# Altium project Battery Management Board.PrjPcb
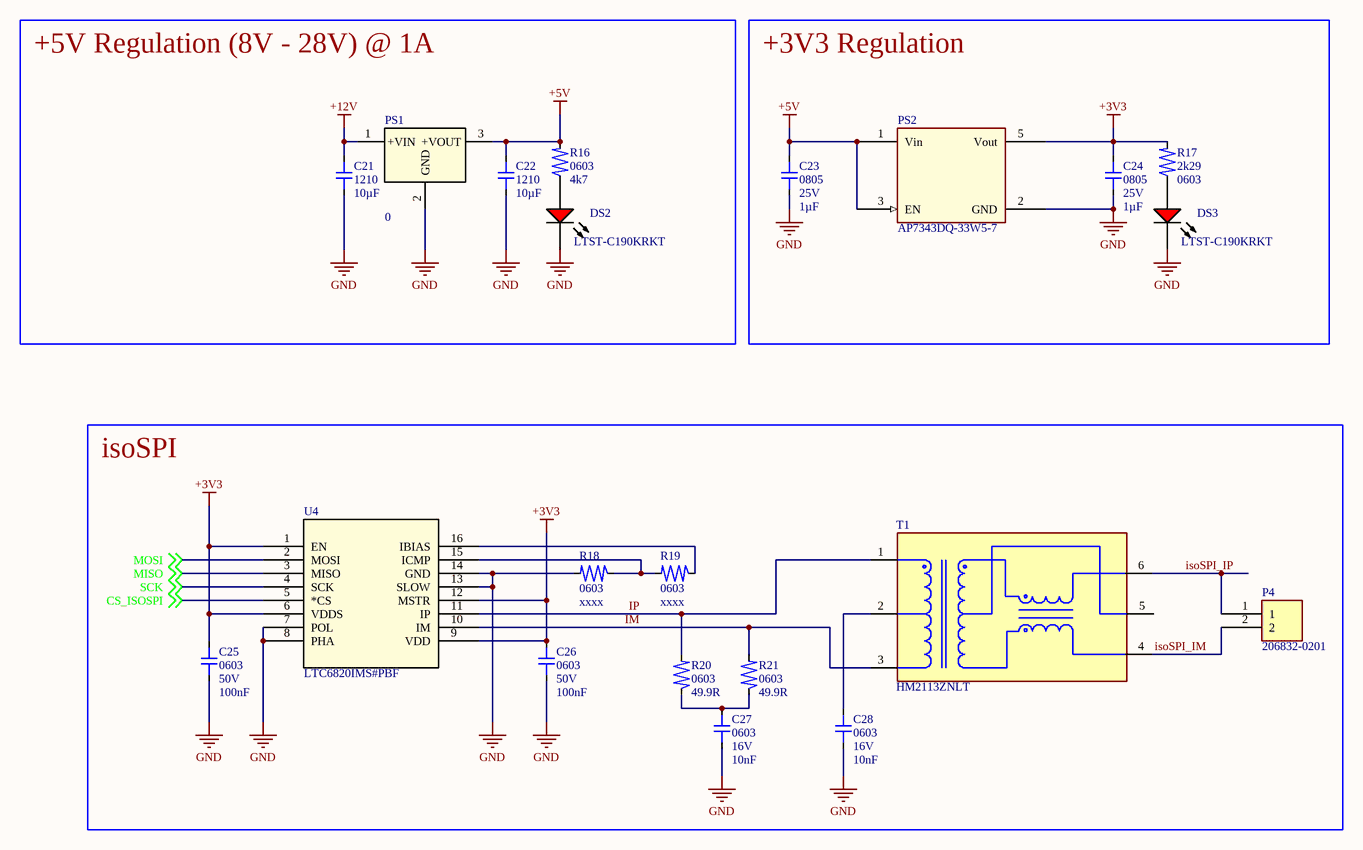
[diagram p0: Power Management.SchDoc]
Comment_1: Initial Release of Schematic; Date_1: 5/17/2024; DrawnBy_1: Ethan Zifzal; PartNumber: EL#####; ProjectTitle: STM32F405 MCU Template; Revision: AA; Revision_1: AA
4 sheets, 116 parts. Net scope: global (net labels, ports and power ports of the same name join across sheets).
Board file: BMS REVAA.PcbDoc
Sheets:
  Sheet1.SchDoc
  Power Management.SchDoc
  Shutdown.SchDoc
  STM32.SchDoc

## Sheet Sheet1.SchDoc
size Tabloid; SheetNumber: 1; SheetTotal: 4

### Notes on the sheet
- REVISION
- DATE
- DRAWN BY
- COMMENT
- Notes
- THE UNIVERSITY OF AKRON
- SHEET SIZE
- TITLE
- PART NUMBER
- ANSI B
- LAST UPDATE
- SHEET

## Sheet Power Management.SchDoc
size Tabloid; SheetNumber: 2; SheetTotal: 4

### Parts
C21  value 10µF  Footprint: 1210  [FP-1210-L_3_2_0_3-W_2_5_0-MFG]  (hidden comment: Capacitor 10uF 1210 50V)
C22  value 10µF  Footprint: 1210  [FP-1210-L_3_2_0_3-W_2_5_0-MFG]  (hidden comment: Capacitor 10uF 1210 50V)
C23  value 1µF  Footprint: 0805  Voltage: 25V  [CAP-0805]  (hidden comment: Capacitor 1uF 0805 25V)
C24  value 1µF  Footprint: 0805  Voltage: 25V  [CAP-0805]  (hidden comment: Capacitor 1uF 0805 25V)
C25  value 100nF  Footprint: 0603  Voltage: 50V  [CAP-0603-Generic]  (hidden comment: Capacitor 100nF 0603 5%)
C26  value 100nF  Footprint: 0603  Voltage: 50V  [CAP-0603-Generic]  (hidden comment: Capacitor 100nF 0603 5%)
C27  value 10nF  Footprint: 0603  Voltage: 16V  [CAP-0603-Generic]  (hidden comment: Capacitor 10nF 0603 5%)
C28  value 10nF  Footprint: 0603  Voltage: 16V  [CAP-0603-Generic]  (hidden comment: Capacitor 10nF 0603 5%)
DS2  LTST-C190KRKT  [LTST-C191KRKT_V]
DS3  LTST-C190KRKT  [LTST-C191KRKT_V]
P4  206832-0201  [FP-206832-0201-MFG]
PS1  value 0  [CONV_R-78E5.0-1.0]  (hidden comment: R-78E5.0-1.0)
PS2  AP7343DQ-33W5-7  [SOT95P285X140-5N]
R16  value 4k7  Footprint: 0603  [RES-0603-Generic]  (hidden comment: Resistor 4k7 0603 1%)
R17  value 2k29  Footprint: 0603  [RES-0603-Generic]  (hidden comment: Resistor 2k49 0603 1%)
R18  value xxxx  Footprint: 0603  [RES-0603-Generic]  (hidden comment: XXX)
R19  value xxxx  Footprint: 0603  [RES-0603-Generic]  (hidden comment: XXX)
R20  value 49.9R  Footprint: 0603  [RES-0603-Generic]  (hidden comment: 49R9 0603 1%)
R21  value 49.9R  Footprint: 0603  [RES-0603-Generic]  (hidden comment: 49R9 0603 1%)
T1  HM2113ZNLT  [FP-HM2113ZNLT-MFG]
U4  LTC6820IMS#PBF  [MSOP16_MS_ADI]

### Blocks framed on the sheet
+5V Regulation (8V - 28V) @ 1A: C21 C22 DS2 PS1 R16
+3V3 Regulation: C23 C24 DS3 PS2 R17
isoSPI: C25-C28 P4 R18-R21 T1 U4

### Nets
+3V3: C24.2 C25.2 C26.2 PS2.5(Vout) R17.2 U4.1(EN) U4.6(VDDS) U4.9(VDD) U4.12(MSTR)
+5V: C22.2 C23.2 PS1.3(+VOUT) PS2.1(Vin) PS2.3(EN) R16.2
+12V: C21.2 PS1.1(+VIN)
GND: C21.1 C22.1 C23.1 C24.1 C25.1 C26.1 C27.1 C28.1 DS2.2(K) DS3.2(K) PS1.2(GND) PS2.2(GND) R18.2 U4.7(POL) U4.8(PHA) U4.13(SLOW) U4.14(GND)
CS_ISOSPI: U4.5(*CS) ; off-sheet CS_ISOSPI
IM: R21.2 T1.3 U4.10(IM)
IP: R20.2 T1.1 U4.11(IP)
isoSPI_IM: P4.2 T1.4
isoSPI_IP: P4.1 T1.6
MISO: U4.3(MISO) ; off-sheet MISO
MOSI: U4.2(MOSI) ; off-sheet MOSI
SCK: U4.4(SCK) ; off-sheet SCK
NetC27_2: C27.2 R20.1 R21.1
NetC28_2: C28.2 T1.2
NetDS2_1: DS2.1(A) R16.1
NetDS3_1: DS3.1(A) R17.1
NetR18_1: R18.1 R19.2 U4.15(ICMP)
NetR19_1: R19.1 U4.16(IBIAS)

Not connected (* = marked no-connect by the designer): PS2 4(NC); T1 5

### Notes on the sheet
- THE UNIVERSITY OF AKRON
- SHEET SIZE
- TITLE
- PART NUMBER
- REVISION
- ANSI B
- LAST UPDATE
- SHEET

### Library data of the parts
C21 C22 = CMP-001-00122-1: Capacitor 1210; Capacitor Type: Ceramic; Max Operating Temperature: 85°C; Pins: 2; Mounting Technology: Surface Mount; Case/Package: 1210; Min Operating Temperature: -55°C; RoHS Compliant: Yes; Voltage Rating: 50V
C23 C24 = CMP-00045-1: Capacitor, 0805
C25 C26 = CMP-00030-2: Capacitor, 0603, 5%; Max Operating Temperature: 125°C; Min Operating Temperature: -55°C
C27 C28 = CMP-00044-1: Capacitor, 0603, 5%; Min Operating Temperature: -55°C; Max Operating Temperature: 125°C
DS2 DS3 = CMP-007-00024-2: LED Uni-Color Red, 62.5 mW, 25 mA, -30 to 85 degC, 2-Pin SMD, RoHS, Tape and Reel; Manufacturer: Lite-On; Power: 75mW; Forward Voltage: 2V; Luminous Intensity: 54mcd; Lens Style: Diffused; Viewing Angle: 130degrees; Forward Current: 20mA; Manufacturer URL: http://www.us.liteon.com/; Case/Package: 0603; Datasheet Version: Rev. F, 05/2013; Package Reference: C191KRKT; Datasheet URL: http://optoelectronics.liteon.com/upload/download/DS-22-99-0151/S_110_LTST-C190KRKT.pdf; Package Description: 2-Pin Surface Mount Device, Body 1.6 x 0.8 mm; Nominal Vf: 2V; Packaging: TapeandReel; RoHS Compliant: True; Pins: 2; Illumination Colour: Red; Colour: Red; Mounting Technology: SM; Package Quantity: 3000; Min Operating Temperature: -55°C; Max Operating Temperature: 85°C
P4 = CMP-002-00123-3: Molex, Micro-Fit+, 2 Position, Dual-Row, Header, Male, 3mm Pitch; Max Current Rating: 13A; Voltage Rating: 600V
PS1 = CMP-009-00214-2: Linear Regulator Replacement DC DC Converter 1 Output 5V - - 1A 8V - 28V Input; MF: Recom Power; Price: None; Availability: Unavailable; SnapEDA_Link: https://www.snapeda.com/parts/R-78E5.0-1.0/Recom%20Power/view-part/557753/?ref=snap; Case/Package: SIP-3 Recom Power; Design Item ID: R-78E5.0-1.0; MP: R-78E5.0-1.0; Source: Zips_Racing_Electric.SchLib
PS2 = CMP-019-00053-6: Fixed Positive LDO Regulator; Min Supply Voltage: 1.7V; Output Current: 300mA; Max Supply Voltage: 5.25V; Output Voltage: 3.3V; Dropout Voltage: 310mV; Mounting Technology: SMT; Min Operating Temperature: -40°C; Pins: 5; Case/Package: SOT-25; Max Operating Temperature: 125°C
R16 = CMP-00023-3: Resistor, 0603, 1%, 1/10W; Power: 100mW; Tolerance: 1%; Datasheet: https://www.seielect.com/catalog/sei-rmcf_rmcp.pdf; Max Operating Temperature: 155°C; Min Operating Temperature: -55°C
R17 = CMP-00028-1: Resistor, 0603, 1%, 1/10W; Power: 100mW; Max Operating Temperature: 155°C; Min Operating Temperature: -55°C; Tolerance: 1%; Datasheet: https://www.seielect.com/catalog/sei-rmcf_rmcp.pdf
R18 R19 = CMP-00061-1: Resistor, 0603, 49R9; Tolerance: 1%; Power: 100mW; Max Operating Temperature: 155°C; Datasheet: https://www.seielect.com/catalog/sei-rmcf_rmcp.pdf; Min Operating Temperature: -55°C
R20 R21 = CMP-00061-1: Resistor, 0603, 49R9; Power: 100mW; Max Operating Temperature: 155°C; Tolerance: 1%; Datasheet: https://www.seielect.com/catalog/sei-rmcf_rmcp.pdf; Min Operating Temperature: -55°C
T1 = CMP-012-00001-1: Datacom Transformer; RoHS Compliant: Yes; Transformer Type: DATACOM TRANSFORMER
U4 = CMP-023-000016-1: Isolated Communications Interface Interface 16-MSOP; Mfr_Name: Analog Devices Inc; Source: Zips_Racing_Electric.SchLib; Type: DEV; Manufacturer_Part_Number: LTC6820IMS#PBF; Digi-Key_Part_Number_1: LTC6820IMS#PBF-ND; RefDes: RefDes; Copyright: Copyright (C) 2021 Ultra Librarian. All rights reserved.; Design Item ID: LTC6820IMS#PBF

## Sheet Shutdown.SchDoc
size Tabloid; SheetNumber: 3; SheetTotal: 4
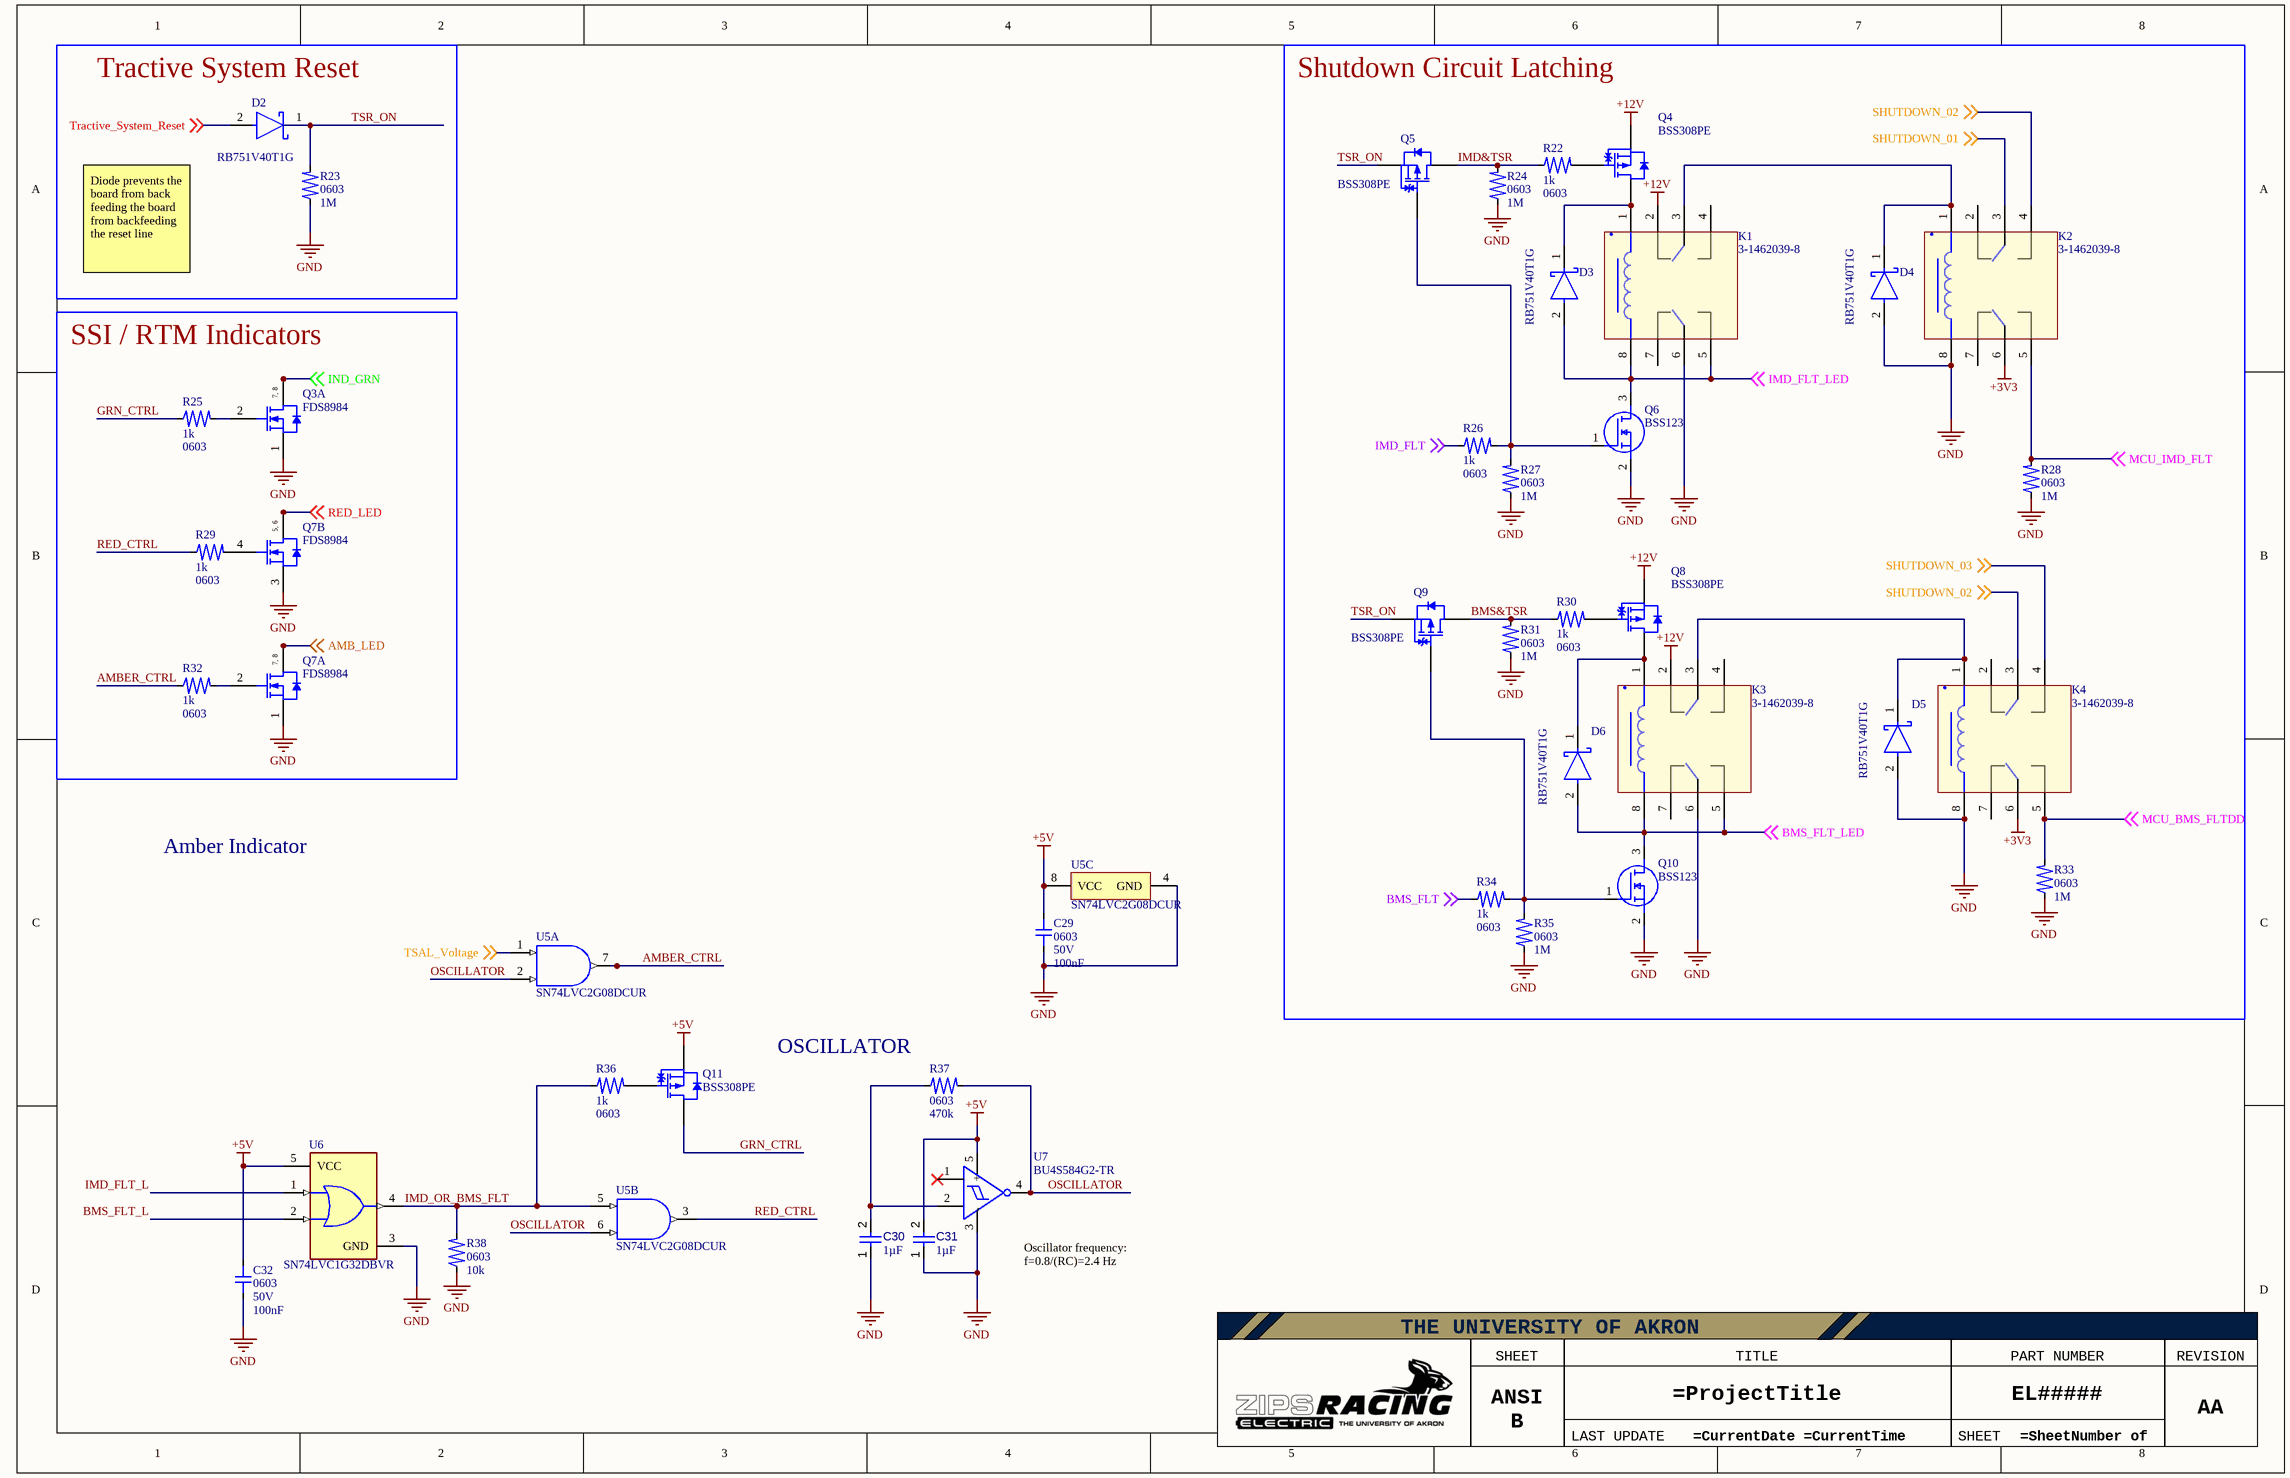
[diagram p1: Shutdown.SchDoc]

### Parts
C29  value 100nF  Footprint: 0603  Voltage: 50V  [CAP-0603-Generic]  (hidden comment: Capacitor 100nF 0603 5%)
C30  value 1µF  [CAPC1608X94X35NL15T15]  (hidden comment: Capacitor 1 uF +/- 10% 16 V 0603)
C31  value 1µF  [CAPC1608X94X35NL15T15]  (hidden comment: Capacitor 1 uF +/- 10% 16 V 0603)
C32  value 100nF  Footprint: 0603  Voltage: 50V  [CAP-0603-Generic]  (hidden comment: Capacitor 100nF 0603 5%)
D2  RB751V40T1G  [FP-477-02-MFG]
D3  RB751V40T1G  [FP-477-02-MFG]
D4  RB751V40T1G  [FP-477-02-MFG]
D5  RB751V40T1G  [FP-477-02-MFG]
D6  RB751V40T1G  [FP-477-02-MFG]
K1  3-1462039-8  [FP-3-1462039-8-MFG]
K2  3-1462039-8  [FP-3-1462039-8-MFG]
K3  3-1462039-8  [FP-3-1462039-8-MFG]
K4  3-1462039-8  [FP-3-1462039-8-MFG]
Q3  FDS8984  [FAIR-SOIC-8_V]  (part A of 2)
Q4  BSS308PE  [INF-PG-SOT23_M]
Q5  BSS308PE  [INF-PG-SOT23_M]
Q6  BSS123  [SOT96P237X111-3N]
Q7  FDS8984  [FAIR-SOIC-8_V]  (parts A,B of 2)
Q8  BSS308PE  [INF-PG-SOT23_M]
Q9  BSS308PE  [INF-PG-SOT23_M]
Q10  BSS123  [SOT96P237X111-3N]
Q11  BSS308PE  [INF-PG-SOT23_M]
R22  value 1k  Footprint: 0603  [RES-0603-Generic]  (hidden comment: Resistor 1k 0603 1%)
R23  value 1M  Footprint: 0603  [RES-0603-Generic]  (hidden comment: Resistor 1M 0603 1%)
R24  value 1M  Footprint: 0603  [RES-0603-Generic]  (hidden comment: Resistor 1M 0603 1%)
R25  value 1k  Footprint: 0603  [RES-0603-Generic]  (hidden comment: Resistor 1k 0603 1%)
R26  value 1k  Footprint: 0603  [RES-0603-Generic]  (hidden comment: Resistor 1k 0603 1%)
R27  value 1M  Footprint: 0603  [RES-0603-Generic]  (hidden comment: Resistor 1M 0603 1%)
R28  value 1M  Footprint: 0603  [RES-0603-Generic]  (hidden comment: Resistor 1M 0603 1%)
R29  value 1k  Footprint: 0603  [RES-0603-Generic]  (hidden comment: Resistor 1k 0603 1%)
R30  value 1k  Footprint: 0603  [RES-0603-Generic]  (hidden comment: Resistor 1k 0603 1%)
R31  value 1M  Footprint: 0603  [RES-0603-Generic]  (hidden comment: Resistor 1M 0603 1%)
R32  value 1k  Footprint: 0603  [RES-0603-Generic]  (hidden comment: Resistor 1k 0603 1%)
R33  value 1M  Footprint: 0603  [RES-0603-Generic]  (hidden comment: Resistor 1M 0603 1%)
R34  value 1k  Footprint: 0603  [RES-0603-Generic]  (hidden comment: Resistor 1k 0603 1%)
R35  value 1M  Footprint: 0603  [RES-0603-Generic]  (hidden comment: Resistor 1M 0603 1%)
R36  value 1k  Footprint: 0603  [RES-0603-Generic]  (hidden comment: Resistor 1k 0603 1%)
R37  value 470k  Footprint: 0603  [RES-0603-Generic]  (hidden comment: Resistor 470k 0603 1%)
R38  value 10k  Footprint: 0603  [RES-0603-Generic]  (hidden comment: Resistor 10k 0603 1%)
U5  SN74LVC2G08DCUR  [DCU0008A_N]  (parts A,B,C of 3)
U6  SN74LVC1G32DBVR  [FP-DBV0005A-MFG]
U7  BU4S584G2-TR  [SSOP5_ROM]

### Blocks framed on the sheet
Tractive System Reset: D2 R23
Shutdown Circuit Latching: D3-D6 K1-K4 Q4-Q6 Q8-Q10 R22 R24 R26-R28 R30 R31 R33-R35
SSI / RTM Indicators: Q3 Q7 R25 R29 R32

### Nets
+3V3: K2.6 K4.6
+5V: C29.2 C31.2 C32.2 Q11.2(SOURCE) U5.8(VCC) U6.5(VCC) U7.5(+)
+12V: K1.2 K3.2 Q4.2(SOURCE) Q8.2(SOURCE)
GND: C29.1 C30.1 C31.1 C32.1 D4.2(A) D5.2(A) K1.6 K2.8 K3.6 K4.8 Q3.1(S1) Q6.2(S) Q7.1(S1) Q7.3(S2) Q10.2(S) R23.1 R24.1 R27.1 R28.1 R31.1 R33.1 R35.1 R38.1 U5.4(GND) U6.3(GND) U7.3(-)
AMB_LED: Q7.7(D1) Q7.8(D1) ; off-sheet AMB_LED
AMBER_CTRL: R32.1 U5.7(1Y)
BMS&TSR: Q9.3(DRAIN) R30.1 R31.2
BMS_FLT: R34.1 ; off-sheet BMS_FLT
BMS_FLT_L: U6.2(B)
BMS_FLT_LED: D6.2(A) K3.5 K3.8 Q10.3(D) ; off-sheet BMS_FLT_LED
GRN_CTRL: Q11.3(DRAIN) R25.1
IMD&TSR: Q5.3(DRAIN) R22.1 R24.2
IMD_FLT: R26.1 ; off-sheet IMD_FLT
IMD_FLT_L: U6.1(A)
IMD_FLT_LED: D3.2(A) K1.5 K1.8 Q6.3(D) ; off-sheet IMD_FLT_LED
IMD_OR_BMS_FLT: R36.1 R38.2 U5.5(2A) U6.4(Y)
IND_GRN: Q3.7(D1) Q3.8(D1) ; off-sheet IND_GRN
MCU_BMS_FLTDD: K4.5 R33.2 ; off-sheet MCU_BMS_FLTDD
MCU_IMD_FLT: K2.5 R28.2 ; off-sheet MCU_IMD_FLT
OSCILLATOR: R37.2 U5.2(1B) U5.6(2B) U7.4
RED_CTRL: R29.1 U5.3(2Y)
RED_LED: Q7.5(D2) Q7.6(D2) ; off-sheet RED_LED
SHUTDOWN_01: K2.3 ; off-sheet SHUTDOWN_01
SHUTDOWN_02: K2.4 K4.3 ; off-sheet SHUTDOWN_02
SHUTDOWN_03: K4.4 ; off-sheet SHUTDOWN_03
Tractive_System_Reset: D2.2(A) ; off-sheet Tractive_System_Reset
TSAL_Voltage: U5.1(1A) ; off-sheet TSAL_Voltage
TSR_ON: D2.1(C) Q5.2(SOURCE) Q9.2(SOURCE) R23.2
NetC30_2: C30.2 R37.1 U7.2
NetD3_1: D3.1(C) K1.1 Q4.3(DRAIN)
NetD4_1: D4.1(C) K1.3 K2.1
NetD5_1: D5.1(C) K3.3 K4.1
NetD6_1: D6.1(C) K3.1 Q8.3(DRAIN)
NetQ3_2: Q3.2(G1) R25.2
NetQ4_1: Q4.1(GATE) R22.2
NetQ5_1: Q5.1(GATE) Q6.1(G) R26.2 R27.2
NetQ7_2: Q7.2(G1) R32.2
NetQ7_4: Q7.4(G2) R29.2
NetQ8_1: Q8.1(GATE) R30.2
NetQ9_1: Q9.1(GATE) Q10.1(G) R34.2 R35.2
NetQ11_1: Q11.1(GATE) R36.2

Not connected (* = marked no-connect by the designer): K1 4 7; K2 2 7; K3 4 7; K4 2 7; U7 1(NC)*

### Notes on the sheet
- Diode prevents the board from back feeding the board from backfeeding the reset line
- Amber Indicator
- (near R37) OSCILLATOR
- (near U7) Oscillator frequency:
  f=0.8/(RC)=2.4 Hz
- THE UNIVERSITY OF AKRON
- SHEET SIZE
- TITLE
- PART NUMBER
- REVISION
- ANSI B
- LAST UPDATE
- SHEET
- (in symbol CMP-008-00010-2) .
- (in symbol CMP-013-00045-1, part A) 7, 8
- (in symbol CMP-013-00045-1, part B) 5, 6

### Library data of the parts
C29 C32 = CMP-00030-2: Capacitor, 0603, 5%; Max Operating Temperature: 125°C; Min Operating Temperature: -55°C
C30 C31 = CMP-001-00003-6: Chip Capacitor, 1 uF, +/- 10%, 16 V, 0603 (1608 Metric); Voltage Rating: 16V; Capacitor Type: Ceramic; Max Operating Temperature: 125°C; Pins: 2; Tolerance: 10%; Min Operating Temperature: -55°C; RoHS Compliant: True; Mounting Technology: SM; Case/Package: 0603
D2-D6 = CMP-004-00075-1: Rectifier Diode, Schottky, 1 Phase, 1 Element, 0.03A, 40V V(RRM), Silicon; Forward Voltage: 370mV; Pins: 2; RoHS Compliant: Yes; Max Operating Temperature: 150°C; Min Operating Temperature: -55°C
K1-K4 = CMP-008-00010-2: Power/Signal Relay, 2 Form C, DPDT, Momentary, 0.01A (Coil), 12VDC (Coil), 140mW (Coil), 5A (Contact), 220VDC (Contact), DC Input, Random, AC/DC Output, Through Hole-Straight Mount; Operate Time: 3ms; Mounting Technology: Through-hole; Pins: 8; Max Operating Temperature: 85°C; Current Rating: 5A; Min Operating Temperature: -40°C; Contact Form: DPDT; RoHS Compliant: Yes; ComponentLink1URL: https://www.te.com/commerce/DocumentDelivery/DDEController?Action=srchrtrv&DocNm=108-98001&DocType=Data+Sheet&DocLang=English&DocFormat=pdf&PartCntxt=3-1462039-8; ComponentLink1Description: Datasheet
Q3 Q7 = CMP-013-00045-1: Power Field-Effect Transistor, 7A I(D), 30V, 0.032ohm, 2-Element, N-Channel, Silicon, Metal-oxide Semiconductor FET; Max Operating Temperature: 150°C; Pins: 8; RoHS Compliant: Yes
Q4 Q5 Q8 Q9 Q11 = CMP-013-00040-1: Small Signal Field-Effect Transistor, 2A I(D), 30V, 1-Element, P-Channel, Silicon, Metal-oxide Semiconductor FET; Pins: 3; RoHS Compliant: Yes
Q6 Q10 = CMP-023-000002-1: MOSFET N-CH 100V 170MA SOT23-3; Manufacturer_Name: ON Semiconductor; Datasheet Link: http://uk.rs-online.com/web/p/products/6710321; Mouser Price/Stock: https://www.mouser.co.uk/ProductDetail/ON-Semiconductor-Fairchild/BSS123?qs=FOlmdCx%252BAA2Kf8SEB3qLYA%3D%3D; Arrow Part Number: BSS123; Arrow Price/Stock: https://www.arrow.com/en/products/bss123/on-semiconductor; Manufacturer_Part_Number: BSS123; Source: Zips_Racing_Electric.SchLib; Design Item ID: BSS123; Height: 1.11mm; Mouser Part Number: 512-BSS123
R22 R25 R26 R29 R30 R32 R34 R36 = CMP-00021-7: Resistor, 0603, 1k; Power: 100mW; Max Operating Temperature: 155°C; Min Operating Temperature: -55°C; Datasheet: https://www.seielect.com/catalog/sei-rmcf_rmcp.pdf; Tolerance: 1%
R23 R24 R27 R28 R31 R33 R35 = CMP-00041-2: Resistor, 0603, 1%, 1/10W; Power: 100mW; Tolerance: 1%; Datasheet: https://www.seielect.com/catalog/sei-rmcf_rmcp.pdf; Max Operating Temperature: 155°C; Min Operating Temperature: -55°C
R37 = CMP-00018-2: Resistor, 0603, 1%, 1/10W; Power: 100mW; Min Operating Temperature: -55°C; Tolerance: 1%; Datasheet: https://www.seielect.com/catalog/sei-rmcf_rmcp.pdf; Max Operating Temperature: 155°C
R38 = CMP-00020-12: Resistor, 0603, 10k; Power: 100mW; Minimum Operating Temperature: -55°C; Tolerance: 1%; Maximum Operating Temperature: 155°C; Max Operating Temperature: 155°C; Min Operating Temperature: -55°C; Datasheet: https://www.seielect.com/catalog/sei-rmcf_rmcp.pdf
U5 = CMP-016-00027-1: AND Gate, LVC/LCX/Z Series, 2-Func, 2-Input, CMOS, PDSO8; Min Supply Voltage: 1.65V; Max Supply Voltage: 5.5V; Nominal Supply Voltage: 1.8V; RoHS Compliant: Yes; Case/Package: VSSOP; Pins: 8; Min Operating Temperature: -40°C; Logic Type: AND GATE; Max Operating Temperature: 125°C
U6 = CMP-016-00020-1: OR Gate, LVC/LCX/Z Series, 1-Func, 2-Input, CMOS, PDSO5; Min Supply Voltage: 1.65V; Logic Type: OR GATE; Nominal Supply Voltage: 3.3V; Max Supply Voltage: 5.5V; Min Operating Temperature: -40°C; Max Operating Temperature: 125°C; Pins: 5; Case/Package: LSSOP; RoHS Compliant: Yes
U7 = CMP-031-00016-1: Inverter IC 1 Channel Schmitt Trigger 5-SSOP; Mfr_Name: ROHM Semiconductor; Manufacturer_Part_Number: BU4S584G2-TR; Copyright: Copyright (C) 2021 Ultra Librarian. All rights reserved.; Design Item ID: BU4S584G2-TR; RefDes: RefDes; Digi-Key_Part_Number_1: BU4S584G2TR-ND; Type: DEV; Digi-Key_Part_Number_2: BU4S584G2CT-ND; Source: Zips_Racing_Electric.SchLib; Digi-Key_Part_Number_3: BU4S584G2DKR-ND

## Sheet STM32.SchDoc
size Tabloid; SheetNumber: 4; SheetTotal: 4
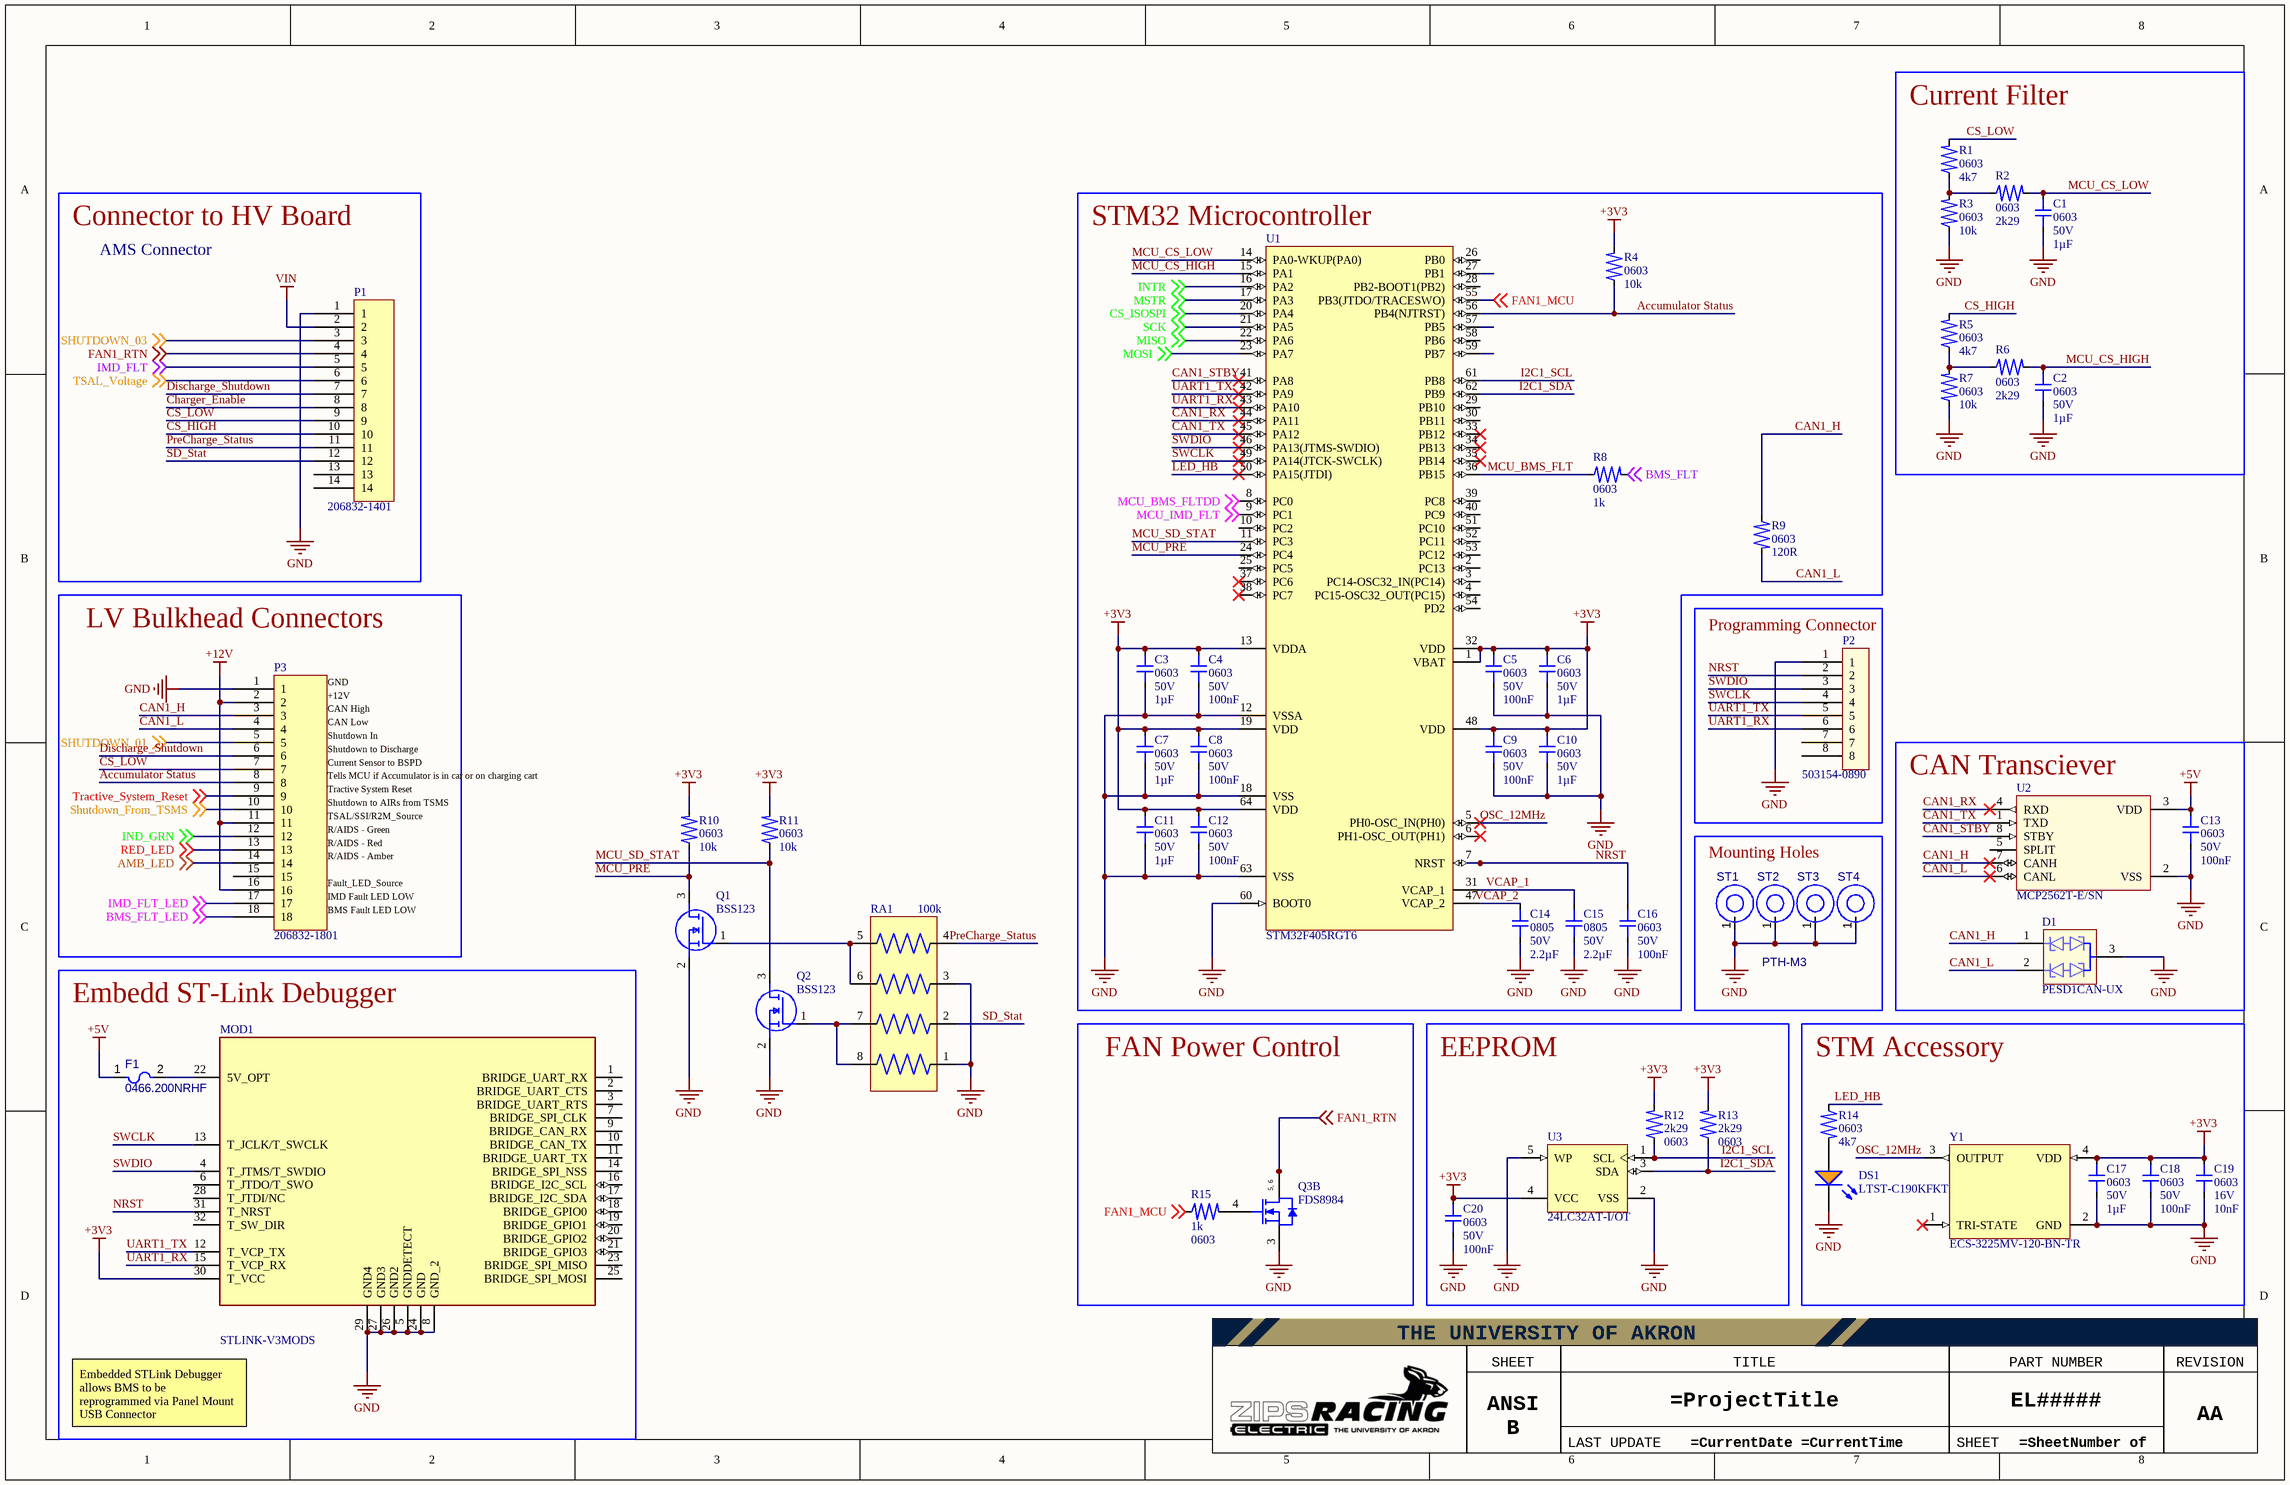
[diagram p2: STM32.SchDoc]

### Parts
C1  value 1µF  Footprint: 0603  Voltage: 50V  [CAP-0603-Generic]  (hidden comment: Capacitor 1uF 0603 5%)
C2  value 1µF  Footprint: 0603  Voltage: 50V  [CAP-0603-Generic]  (hidden comment: Capacitor 1uF 0603 5%)
C3  value 1µF  Footprint: 0603  Voltage: 50V  [CAP-0603-Generic]  (hidden comment: Capacitor 1uF 0603 5%)
C4  value 100nF  Footprint: 0603  Voltage: 50V  [CAP-0603-Generic]  (hidden comment: Capacitor 100nF 0603 5%)
C5  value 100nF  Footprint: 0603  Voltage: 50V  [CAP-0603-Generic]  (hidden comment: Capacitor 100nF 0603 5%)
C6  value 1µF  Footprint: 0603  Voltage: 50V  [CAP-0603-Generic]  (hidden comment: Capacitor 1uF 0603 5%)
C7  value 1µF  Footprint: 0603  Voltage: 50V  [CAP-0603-Generic]  (hidden comment: Capacitor 1uF 0603 5%)
C8  value 100nF  Footprint: 0603  Voltage: 50V  [CAP-0603-Generic]  (hidden comment: Capacitor 100nF 0603 5%)
C9  value 100nF  Footprint: 0603  Voltage: 50V  [CAP-0603-Generic]  (hidden comment: Capacitor 100nF 0603 5%)
C10  value 1µF  Footprint: 0603  Voltage: 50V  [CAP-0603-Generic]  (hidden comment: Capacitor 1uF 0603 5%)
C11  value 1µF  Footprint: 0603  Voltage: 50V  [CAP-0603-Generic]  (hidden comment: Capacitor 1uF 0603 5%)
C12  value 100nF  Footprint: 0603  Voltage: 50V  [CAP-0603-Generic]  (hidden comment: Capacitor 100nF 0603 5%)
C13  value 100nF  Footprint: 0603  Voltage: 50V  [CAP-0603-Generic]  (hidden comment: Capacitor 100nF 0603 5%)
C14  value 2.2µF  Footprint: 0805  Voltage: 50V  [CAP-0805]  (hidden comment: Capacitor 2.2F 0805 5%)
C15  value 2.2µF  Footprint: 0805  Voltage: 50V  [CAP-0805]  (hidden comment: Capacitor 2.2F 0805 5%)
C16  value 100nF  Footprint: 0603  Voltage: 50V  [CAP-0603-Generic]  (hidden comment: Capacitor 100nF 0603 5%)
C17  value 1µF  Footprint: 0603  Voltage: 50V  [CAP-0603-Generic]  (hidden comment: Capacitor 1uF 0603 5%)
C18  value 100nF  Footprint: 0603  Voltage: 50V  [CAP-0603-Generic]  (hidden comment: Capacitor 100nF 0603 5%)
C19  value 10nF  Footprint: 0603  Voltage: 16V  [CAP-0603-Generic]  (hidden comment: Capacitor 10nF 0603 5%)
C20  value 100nF  Footprint: 0603  Voltage: 50V  [CAP-0603-Generic]  (hidden comment: Capacitor 100nF 0603 5%)
D1  PESD1CAN-UX  [FP-SOT323-MFG]
DS1  LTST-C190KFKT  [LTST-C190KFKT_V]
F1  0466.200NRHF  [FP-0466-MFG]
MOD1  STLINK-V3MODS  [STLINK-V3MODS-Footprint-1]
P1  206832-1401  [206832-1001-Footprint-1]
P2  503154-0890  [FP-503154-0890-MFG]
P3  206832-1801  [MOLEX_2068321801]
Q1  BSS123  [SOT96P237X111-3N]
Q2  BSS123  [SOT96P237X111-3N]
Q3  FDS8984  [FAIR-SOIC-8_V]  (part B of 2)
R1  value 4k7  Footprint: 0603  [RES-0603-Generic]  (hidden comment: Resistor 4k7 0603 1%)
R2  value 2k29  Footprint: 0603  [RES-0603-Generic]  (hidden comment: Resistor 2k49 0603 1%)
R3  value 10k  Footprint: 0603  [RES-0603-Generic]  (hidden comment: Resistor 10k 0603 1%)
R4  value 10k  Footprint: 0603  [RES-0603-Generic]  (hidden comment: Resistor 10k 0603 1%)
R5  value 4k7  Footprint: 0603  [RES-0603-Generic]  (hidden comment: Resistor 4k7 0603 1%)
R6  value 2k29  Footprint: 0603  [RES-0603-Generic]  (hidden comment: Resistor 2k49 0603 1%)
R7  value 10k  Footprint: 0603  [RES-0603-Generic]  (hidden comment: Resistor 10k 0603 1%)
R8  value 1k  Footprint: 0603  [RES-0603-Generic]  (hidden comment: Resistor 1k 0603 1%)
R9  value 120R  Footprint: 0603  [RES-0603-Generic]  (hidden comment: Resistor 120R 0603 1%)
R10  value 10k  Footprint: 0603  [RES-0603-Generic]  (hidden comment: Resistor 10k 0603 1%)
R11  value 10k  Footprint: 0603  [RES-0603-Generic]  (hidden comment: Resistor 10k 0603 1%)
R12  value 2k29  Footprint: 0603  [RES-0603-Generic]  (hidden comment: Resistor 2k49 0603 1%)
R13  value 2k29  Footprint: 0603  [RES-0603-Generic]  (hidden comment: Resistor 2k49 0603 1%)
R14  value 4k7  Footprint: 0603  [RES-0603-Generic]  (hidden comment: Resistor 4k7 0603 1%)
R15  value 1k  Footprint: 0603  [RES-0603-Generic]  (hidden comment: Resistor 1k 0603 1%)
RA1  value 100k  [New footprint 1]  (hidden comment: YC164-JR-07100KL)
ST1  PTH-M3  [PTH-M2D5X5]  (no BOM)
ST2  PTH-M3  [PTH-M2D5X5]  (value not drawn)  (no BOM)
ST3  PTH-M3  [PTH-M2D5X5]  (value not drawn)  (no BOM)
ST4  PTH-M3  [PTH-M2D5X5]  (value not drawn)  (no BOM)
U1  STM32F405RGT6  [STM-LQFP64_V]
U2  MCP2562T-E/SN  [MCP2562T-E_SN-Footprint-1]
U3  24LC32AT-I/OT  [SOT-23-OT5_L]
Y1  ECS-3225MV-120-BN-TR  [ECS-3225MV-120-BN-TR-Footprint-1]

### Blocks framed on the sheet
Current Filter: C1 C2 R1-R3 R5-R7
Connector to HV Board: P1
STM32 Microcontroller: C3-C12 C14-C16 R4 R8 R9 U1
LV Bulkhead Connectors: P3
Programming Connector: P2
CAN Transciever: C13 D1 U2
Mounting Holes: ST1-ST4
Embedd ST-Link Debugger: F1 MOD1
FAN Power Control: Q3 R15
EEPROM: C20 R12 R13 U3
STM Accessory: C17-C19 DS1 R14 Y1

### Nets
+3V3: C3.2 C4.2 C5.2 C6.2 C7.2 C8.2 C9.2 C10.2 C11.2 C12.2 C17.2 C18.2 C19.2 C20.2 MOD1.30(T_VCC) R4.2 R10.2 R11.2 R12.2 R13.2 U1.1(VBAT) U1.13(VDDA) U1.19(VDD) U1.32(VDD) U1.48(VDD) U1.64(VDD) U3.4(VCC) Y1.4(VDD)
+5V: C13.2 F1.1 U2.3(VDD)
+12V: P3.2 P3.11 P3.16
GND: C1.1 C2.1 C3.1 C4.1 C5.1 C6.1 C7.1 C8.1 C9.1 C10.1 C11.1 C12.1 C13.1 C14.1 C15.1 C16.1 C17.1 C18.1 C19.1 C20.1 D1.3(common_cathode) DS1.2(K) MOD1.5(GNDDETECT) MOD1.8(GND_2) MOD1.24(GND) MOD1.26(GND2) MOD1.27(GND3) MOD1.29(GND4) P1.1 P2.1 P3.1 Q1.2(S) Q2.2(S) Q3.3(S2) R3.1 R7.1 RA1.1 RA1.3 ST1.1(H1) ST2.1(H1) ST3.1(H1) ST4.1(H1) U1.12(VSSA) U1.18(VSS) U1.60(BOOT0) U1.63(VSS) U2.2(VSS) U3.2(VSS) U3.5(WP) Y1.2(GND)
VIN: P1.2
Accumulator Status: P3.8 R4.1 U1.56(PB4(NJTRST))
AMB_LED: P3.14 ; off-sheet AMB_LED
BMS_FLT: R8.2 ; off-sheet BMS_FLT
BMS_FLT_LED: P3.18 ; off-sheet BMS_FLT_LED
CAN1_H: D1.1(cathode_1) P3.3 R9.1 U2.7(CANH)
CAN1_L: D1.2(cathode_2) P3.4 R9.2 U2.6(CANL)
CAN1_RX: U1.44(PA11) U2.4(RXD)
CAN1_STBY: U1.41(PA8) U2.8(STBY)
CAN1_TX: U1.45(PA12) U2.1(TXD)
Charger_Enable: P1.8
CS_HIGH: P1.10 R5.2
CS_ISOSPI: U1.20(PA4) ; off-sheet CS_ISOSPI
CS_LOW: P1.9 P3.7 R1.2
Discharge_Shutdown: P1.7 P3.6
FAN1_MCU: R15.1 U1.55(PB3(JTDO/TRACESWO)) ; off-sheet FAN1_MCU
FAN1_RTN: P1.4 Q3.5(D2) Q3.6(D2) ; off-sheet FAN1_RTN
I2C1_SCL: R12.1 U1.61(PB8) U3.1(SCL)
I2C1_SDA: R13.1 U1.62(PB9) U3.3(SDA)
IMD_FLT: P1.5 ; off-sheet IMD_FLT
IMD_FLT_LED: P3.17 ; off-sheet IMD_FLT_LED
IND_GRN: P3.12 ; off-sheet IND_GRN
INTR: U1.16(PA2) ; off-sheet INTR
LED_HB: R14.1 U1.50(PA15(JTDI))
MCU_BMS_FLT: R8.1 U1.36(PB15)
MCU_BMS_FLTDD: U1.8(PC0) ; off-sheet MCU_BMS_FLTDD
MCU_CS_HIGH: C2.2 R6.2 U1.15(PA1)
MCU_CS_LOW: C1.2 R2.2 U1.14(PA0-WKUP(PA0))
MCU_IMD_FLT: U1.9(PC1) ; off-sheet MCU_IMD_FLT
MCU_PRE: Q1.3(D) R10.1 U1.24(PC4)
MCU_SD_STAT: Q2.3(D) R11.1 U1.11(PC3)
MISO: U1.22(PA6) ; off-sheet MISO
MOSI: U1.23(PA7) ; off-sheet MOSI
MSTR: U1.17(PA3) ; off-sheet MSTR
NRST: C16.2 MOD1.31(T_NRST) P2.2 U1.7(NRST)
OSC_12MHz: U1.5(PH0-OSC_IN(PH0)) Y1.3(OUTPUT)
PreCharge_Status: P1.11 RA1.4
RED_LED: P3.13 ; off-sheet RED_LED
SCK: U1.21(PA5) ; off-sheet SCK
SD_Stat: P1.12 RA1.2
SHUTDOWN_01: P3.5 ; off-sheet SHUTDOWN_01
SHUTDOWN_03: P1.3 ; off-sheet SHUTDOWN_03
Shutdown_From_TSMS: P3.10 ; off-sheet Shutdown_From_TSMS
SWCLK: MOD1.13(T_JCLK/T_SWCLK) P2.4 U1.49(PA14(JTCK-SWCLK))
SWDIO: MOD1.4(T_JTMS/T_SWDIO) P2.3 U1.46(PA13(JTMS-SWDIO))
Tractive_System_Reset: P3.9 ; off-sheet Tractive_System_Reset
TSAL_Voltage: P1.6 ; off-sheet TSAL_Voltage
UART1_RX: MOD1.15(T_VCP_RX) P2.6 U1.43(PA10)
UART1_TX: MOD1.12(T_VCP_TX) P2.5 U1.42(PA9)
VCAP_1: C15.2 U1.31(VCAP_1)
VCAP_2: C14.2 U1.47(VCAP_2)
NetDS1_1: DS1.1(A) R14.2
NetF1_2: F1.2 MOD1.22(5V_OPT)
NetQ1_1: Q1.1(G) RA1.5 RA1.6
NetQ2_1: Q2.1(G) RA1.7 RA1.8
NetQ3_4: Q3.4(G2) R15.2
NetR1_1: R1.1 R2.1 R3.2
NetR5_1: R5.1 R6.1 R7.2

Not connected (* = marked no-connect by the designer): MOD1 1(BRIDGE_UART_RX) 2(BRIDGE_UART_CTS) 3(BRIDGE_UART_RTS) 6(T_JTDO/T_SWO) 7(BRIDGE_SPI_CLK) 9(BRIDGE_CAN_RX) 10(BRIDGE_CAN_TX) 11(BRIDGE_UART_TX) 14(BRIDGE_SPI_NSS) 16(BRIDGE_I2C_SCL) 17(BRIDGE_I2C_SDA) 18(BRIDGE_GPIO0) 19(BRIDGE_GPIO1) 20(BRIDGE_GPIO2) 21(BRIDGE_GPIO3) 23(BRIDGE_SPI_MISO) 25(BRIDGE_SPI_MOSI) 28(T_JTDI/NC) 32(T_SW_DIR); P1 13 14; P2 7 8; P3 15; U1 2(PC13) 3(PC14-OSC32_IN(PC14)) 4(PC15-OSC32_OUT(PC15)) 6(PH1-OSC_OUT(PH1))* 10(PC2) 25(PC5) 26(PB0) 27(PB1) 28(PB2-BOOT1(PB2)) 29(PB10) 30(PB11) 33(PB12)* 34(PB13)* 35(PB14)* 37(PC6)* 38(PC7)* 39(PC8) 40(PC9) 51(PC10) 52(PC11) 53(PC12) 54(PD2) 57(PB5) 58(PB6) 59(PB7); U2 5(SPLIT); Y1 1(TRI-STATE)*

### Notes on the sheet
- AMS Connector
- GND
- +12V
- CAN High
- CAN Low
- Shutdown In
- Shutdown to Discharge
- Current Sensor to BSPD
- Tractive System Reset
- TSAL/SSI/R2M_Source
- R/AIDS - Green
- Tells MCU if Accumulator is in car or on charging cart
- Shutdown to AIRs from TSMS
- IMD Fault LED LOW
- Fault_LED_Source
- R/AIDS - Red
- R/AIDS - Amber
- BMS Fault LED LOW
- Embedded STLink Debugger allows BMS to be reprogrammed via Panel Mount USB Connector
- THE UNIVERSITY OF AKRON
- SHEET SIZE
- TITLE
- PART NUMBER
- REVISION
- ANSI B
- LAST UPDATE
- SHEET
- (in symbol CMP-013-00045-1, part B) 5, 6

### Library data of the parts
C1-C3 C6 C7 C10 C11 C17 = CMP-00043-1: Capacitor, 0603, 5%; Min Operating Temperature: -55°C; Max Operating Temperature: 85°C
C4 C5 C8 C9 C12 C13 C16 C18 C20 = CMP-00030-2: Capacitor, 0603, 5%; Max Operating Temperature: 125°C; Min Operating Temperature: -55°C
C14 C15 = CMP-00042-1: Capacitor, 0805, 5%
C19 = CMP-00044-1: Capacitor, 0603, 5%; Min Operating Temperature: -55°C; Max Operating Temperature: 125°C
D1 = CMP-004-00033-2: Trans Voltage Suppressor Diode, 150W, 24V V(RWM), Bidirectional, 2 Element, Silicon
DS1 = CMP-007-00023-2: LED Uni-Color Orange, 75 mW, 30 mA, -35 to 85 degC, 2-Pin SMD, RoHS, Tape and Reel; Manufacturer: Lite-On; Power: 75mW; Luminous Intensity: 90mcd; Nominal Vf: 2V; Lens Style: Diffused; Forward Current: 20mA; Viewing Angle: 130degrees; Max Operating Temperature: 85°C; Manufacturer URL: http://www.us.liteon.com/; Package Description: 2-Pin Surface Mount Device, Body 1.6 x 0.8 mm; Package Quantity: 3000; Pins: 2; Min Operating Temperature: -55°C; Mounting Technology: SM; Colour: Orange; Packaging: TapeandReel; Case/Package: 0603; Datasheet Version: Rev. I, 09/2011; Illumination Colour: Orange; Datasheet URL: http://optoelectronics.liteon.com/upload/download/DS-22-99-0186/S_110_LTST-C190KFKT.pdf; Package Reference: C190KFKT; RoHS Compliant: True; Forward Voltage: 2V
F1 = CMP-005-00017-1: Electric Fuse, Very Fast Blow, 0.2A, 125VAC, 125VDC, 50A (IR), Supplemental, Surface Mount, 1206; Current Rating: 200mA; Min Operating Temperature: -55°C; Max Operating Temperature: 90°C; RoHS Compliant: Yes; Mounting Technology: Surface Mount
MOD1 = CMP-00046-2: STLINK V3 Debugger Board Module
P1 = CMP-002-00137-1: MICRO-FIT Plus Header Assembly Dual Row 10 Position Straight Tin
P2 = CMP-002-00140-1: Board Connector, 8 Contact(s), 2 Row(s), Female, Straight, 0.059 inch Pitch, Surface Mount Terminal, Locking, Receptacle; Max Operating Temperature: 105°C; Mounting Technology: Board; RoHS Compliant: Yes; Connector Type: BOARD CONNECTOR; Min Operating Temperature: -40°C
P3 = CMP-002-00147-2: Micro-Fit+ Vertical Header, Through Hole, 3.00mm Pitch, Dual Row, 16 Circuits, 0.38µm Gold (Au) Plating, Glow-Wire Capable, Black, Tray; Plating Material: Tin; Connector Type: PCB Header; Max Current Rating: 12A; Gender: Female; Mating Cylces: 25; Voltage Rating: 600V; ComponentLink1Description: Datasheet; Mounting Technology: Thru-hole; Orientation: Vertical; Pins: 16; ComponentLink1URL: https://www.molex.com/en-us/products/part-detail/2068321601?display=pdf; Max Operating Temperature: 105°C; Min Operating Temperature: -40°C
Q1 Q2 = CMP-023-000002-1: as Q6 on sheet Shutdown; Datasheet Link: http://uk.rs-online.com/web/p/products/6710321; Mouser Price/Stock: https://www.mouser.co.uk/ProductDetail/ON-Semiconductor-Fairchild/BSS123?qs=FOlmdCx%252BAA2Kf8SEB3qLYA%3D%3D; Arrow Part Number: BSS123; Arrow Price/Stock: https://www.arrow.com/en/products/bss123/on-semiconductor; Manufacturer_Part_Number: BSS123; Source: Zips_Racing_Electric.SchLib; Design Item ID: BSS123; Height: 1.11mm; Mouser Part Number: 512-BSS123
Q3 = CMP-013-00045-1: as Q3 on sheet Shutdown; Max Operating Temperature: 150°C; Pins: 8; RoHS Compliant: Yes
R1 R5 R14 = CMP-00023-3: Resistor, 0603, 1%, 1/10W; Power: 100mW; Tolerance: 1%; Datasheet: https://www.seielect.com/catalog/sei-rmcf_rmcp.pdf; Max Operating Temperature: 155°C; Min Operating Temperature: -55°C
R2 R6 R12 R13 = CMP-00028-1: Resistor, 0603, 1%, 1/10W; Power: 100mW; Max Operating Temperature: 155°C; Min Operating Temperature: -55°C; Tolerance: 1%; Datasheet: https://www.seielect.com/catalog/sei-rmcf_rmcp.pdf
R3 R4 R7 R10 R11 = CMP-00020-12: Resistor, 0603, 10k; Power: 100mW; Minimum Operating Temperature: -55°C; Tolerance: 1%; Maximum Operating Temperature: 155°C; Max Operating Temperature: 155°C; Min Operating Temperature: -55°C; Datasheet: https://www.seielect.com/catalog/sei-rmcf_rmcp.pdf
R8 R15 = CMP-00021-7: Resistor, 0603, 1k; Power: 100mW; Max Operating Temperature: 155°C; Min Operating Temperature: -55°C; Datasheet: https://www.seielect.com/catalog/sei-rmcf_rmcp.pdf; Tolerance: 1%
R9 = CMP-00031-1: Resistor, 0603, 1%, 1/10W; Power: 100mW; Datasheet: https://www.seielect.com/catalog/sei-rmcf_rmcp.pdf; Max Operating Temperature: 155°C; Tolerance: 1%; Min Operating Temperature: -55°C
RA1 = CMP-00079-2: Array/Network Resistor, Isolated, Metal Glaze/thick Film, 100000ohm, 50V, 5% +/-Tol, 200ppm/Cel, Surface Mount, 0612; Additional Feature: LASER TRIMMABLE; First Element Resistance: 100kR; Package Height: 0.6mm; Element Power Dissipation: 62.5mW; Package Length: 3.2mm; Number of Elements: 1; Package Width: 1.6mm; Channels: 4; Temperature Coefficient: 200ppm/°C; Rated Temperature: 70°C; Mounting Technology: Surface Mount; Pins: 8; Max Operating Temperature: 155°C; Package Shape: Rectangular; Technology: METAL GLAZE/THICK FILM; Case/Package: 0612; Network Type: Isolated; Construction: Chip; Packaging: Tape and Reel; Termination: Wraparound; Working Voltage: 50V; Tolerance: 5%; Min Operating Temperature: -55°C; RoHS Compliant: Yes; JESD-609 Code: e3; Resistor Type: ARRAY/NETWORK RESISTOR; Terminal Finish: Nickel; Reach SVHC Compliant: Yes
ST1-ST4 = CMP-00028-00008-6: M3 Plated Thru-Hole  (3.2mm), 7mm pad, 10 mm keep out zone; Pins: 1
U1 = CMP-020-00030-5: RISC Microcontroller, 32-Bit, FLASH, CORTEX-M4 CPU, 168MHz, CMOS, PQFP64; Max Supply Voltage: 3.6V; Clock Frequency: 50MHz; Min Supply Voltage: 1.8V; Nominal Supply Voltage: 3.3V; Pins: 64; RoHS Compliant: Yes; Case/Package: LFQFP; Min Operating Temperature: -40°C; Max Operating Temperature: 85°C
U2 = CMP-000001-7: IC TXRX CAN 8SOIC; Receiver Hysteresis: 200mV; Propagation Delay: 125ns; Min Supply Voltage: 1.8V; Operating Supply Current: 70mA; Max Supply Voltage: 5.5V; Simplex/Duplex: Half Duplex; Data Rate: 1Mbps; Packaging: Cut Tape; Mounting Technology: Surface Mount; Lead Free: Lead Free; Case/Package: SOIC; Package Quantity: 3300; Min Operating Temperature: -40°C; Max Operating Temperature: 125°C; Type: Integrated Circuit (IC); Pins: 8
U3 = CMP-019-00068-2: EEPROM, 4KX8, Serial, CMOS, PDSO5; Memory Size: 4096; Clock Frequency: 400kHz; Min Supply Voltage: 2.5V; Max Supply Voltage: 5.5V; Max Operating Temperature: 85°C; Memory Format: EEPROM; Case/Package: LSSOP; RoHS Compliant: Yes; Min Operating Temperature: -40°C; Pins: 5
Y1 = CMP-003-00034-2: HCMOS Output Clock Oscillator, 12MHz Nom; Frequency: 12MHz

## Nets that join several sheets
+3V3: Power Management (9 pins), Shutdown (K2.6 K4.6), STM32 (28 pins)
+5V: Power Management (6 pins), Shutdown (7 pins), STM32 (C13.2 F1.1 U2.3)
+12V: Power Management (C21.2 PS1.1), Shutdown (K1.2 K3.2 Q4.2 Q8.2), STM32 (P3.2 P3.11 P3.16)
GND: Power Management (17 pins), Shutdown (26 pins), STM32 (50 pins)
AMB_LED: Shutdown (Q7.7 Q7.8), STM32 (P3.14)
BMS_FLT: Shutdown (R34.1), STM32 (R8.2)
BMS_FLT_LED: Shutdown (D6.2 K3.5 K3.8 Q10.3), STM32 (P3.18)
CS_ISOSPI: Power Management (U4.5), STM32 (U1.20)
IMD_FLT: Shutdown (R26.1), STM32 (P1.5)
IMD_FLT_LED: Shutdown (D3.2 K1.5 K1.8 Q6.3), STM32 (P3.17)
IND_GRN: Shutdown (Q3.7 Q3.8), STM32 (P3.12)
MCU_BMS_FLTDD: Shutdown (K4.5 R33.2), STM32 (U1.8)
MCU_IMD_FLT: Shutdown (K2.5 R28.2), STM32 (U1.9)
MISO: Power Management (U4.3), STM32 (U1.22)
MOSI: Power Management (U4.2), STM32 (U1.23)
RED_LED: Shutdown (Q7.5 Q7.6), STM32 (P3.13)
SCK: Power Management (U4.4), STM32 (U1.21)
SHUTDOWN_01: Shutdown (K2.3), STM32 (P3.5)
SHUTDOWN_03: Shutdown (K4.4), STM32 (P1.3)
Tractive_System_Reset: Shutdown (D2.2), STM32 (P3.9)
TSAL_Voltage: Shutdown (U5.1), STM32 (P1.6)